# Altium schematic sheet SubBus11.SchDoc
size A
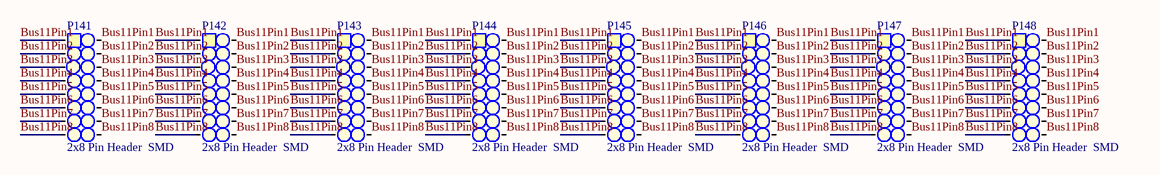
[diagram p0: SubBus11.SchDoc]

## Parts
P141  2x8 Pin Header  SMD  [2X8_SMD_PH_2.54]
P142  2x8 Pin Header  SMD  [2X8_SMD_PH_2.54]
P143  2x8 Pin Header  SMD  [2X8_SMD_PH_2.54]
P144  2x8 Pin Header  SMD  [2X8_SMD_PH_2.54]
P145  2x8 Pin Header  SMD  [2X8_SMD_PH_2.54]
P146  2x8 Pin Header  SMD  [2X8_SMD_PH_2.54]
P147  2x8 Pin Header  SMD  [2X8_SMD_PH_2.54]
P148  2x8 Pin Header  SMD  [2X8_SMD_PH_2.54]

## Nets
Bus11Pin1: P141.1 P141.16 P142.1 P142.16 P143.1 P143.16 P144.1 P144.16 P145.1 P145.16 P146.1 P146.16 P147.1 P147.16 P148.1 P148.16
Bus11Pin2: P141.2 P141.15 P142.2 P142.15 P143.2 P143.15 P144.2 P144.15 P145.2 P145.15 P146.2 P146.15 P147.2 P147.15 P148.2 P148.15
Bus11Pin3: P141.3 P141.14 P142.3 P142.14 P143.3 P143.14 P144.3 P144.14 P145.3 P145.14 P146.3 P146.14 P147.3 P147.14 P148.3 P148.14
Bus11Pin4: P141.4 P141.13 P142.4 P142.13 P143.4 P143.13 P144.4 P144.13 P145.4 P145.13 P146.4 P146.13 P147.4 P147.13 P148.4 P148.13
Bus11Pin5: P141.5 P141.12 P142.5 P142.12 P143.5 P143.12 P144.5 P144.12 P145.5 P145.12 P146.5 P146.12 P147.5 P147.12 P148.5 P148.12
Bus11Pin6: P141.6 P141.11 P142.6 P142.11 P143.6 P143.11 P144.6 P144.11 P145.6 P145.11 P146.6 P146.11 P147.6 P147.11 P148.6 P148.11
Bus11Pin7: P141.7 P141.10 P142.7 P142.10 P143.7 P143.10 P144.7 P144.10 P145.7 P145.10 P146.7 P146.10 P147.7 P147.10 P148.7 P148.10
Bus11Pin8: P141.8 P141.9 P142.8 P142.9 P143.8 P143.9 P144.8 P144.9 P145.8 P145.9 P146.8 P146.9 P147.8 P147.9 P148.8 P148.9

## Library data of the parts
P141-P148 = 2x8 Pin Header  SMD: 2.54mm, SMD; Value: 2x8 Pin Header, 2.54mm, SMD; Farnell: 2356242